# Altium project TurboToster_v.1.0.PrjPcb
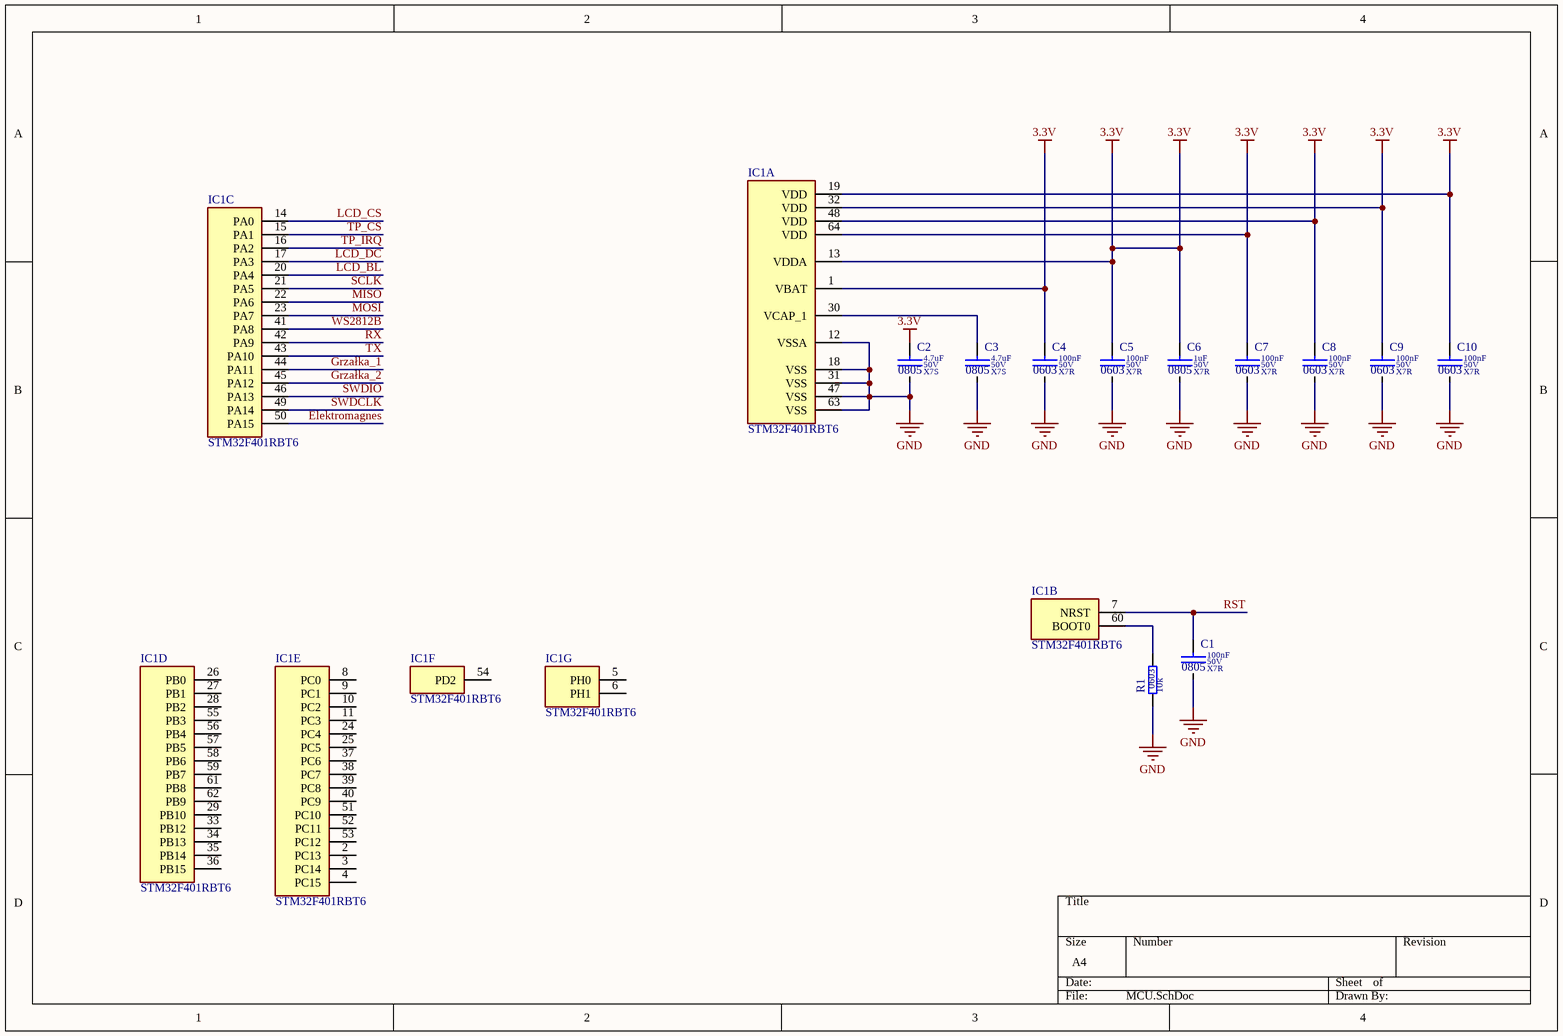
[diagram p0: MCU.SchDoc]
Numer: ---; Rev: v.1.0; Rysował: Eryk / Piotr; Tytuł: TurboToster
3 sheets, 40 parts. Net scope: global (net labels, ports and power ports of the same name join across sheets).
Board file: PCB.PcbDoc
Sheets:
  MCU.SchDoc
  Power.SchDoc
  Peripherals.SchDoc

## Sheet MCU.SchDoc
size A4; SheetNumber: 1; SheetTotal: 3

### Parts
C1  value 100nF  Dielectric: X7R  Voltage: 50V  SCH_Footprint: 0805  [C_0805_2012]  (hidden comment: Ceramic X7R)
C2  value 4.7uF  Dielectric: X7S  Voltage: 50V  SCH_Footprint: 0805  [C_0805_2012]  (hidden comment: Ceramic X7S)
C3  value 4.7uF  Dielectric: X7S  Voltage: 50V  SCH_Footprint: 0805  [C_0805_2012]  (hidden comment: Ceramic X7S)
C4  value 100nF  Dielectric: X7R  Voltage: 50V  SCH_Footprint: 0603  [C_0603_1608]  (hidden comment: Ceramic X7R)
C5  value 100nF  Dielectric: X7R  Voltage: 50V  SCH_Footprint: 0603  [C_0603_1608]  (hidden comment: Ceramic X7R)
C6  value 1uF  Dielectric: X7R  Voltage: 50V  SCH_Footprint: 0805  [C_0805_2012]  (hidden comment: Ceramic X7R)
C7  value 100nF  Dielectric: X7R  Voltage: 50V  SCH_Footprint: 0603  [C_0603_1608]  (hidden comment: Ceramic X7R)
C8  value 100nF  Dielectric: X7R  Voltage: 50V  SCH_Footprint: 0603  [C_0603_1608]  (hidden comment: Ceramic X7R)
C9  value 100nF  Dielectric: X7R  Voltage: 50V  SCH_Footprint: 0603  [C_0603_1608]  (hidden comment: Ceramic X7R)
C10  value 100nF  Dielectric: X7R  Voltage: 50V  SCH_Footprint: 0603  [C_0603_1608]  (hidden comment: Ceramic X7R)
IC1  STM32F401RBT6  [LQFP-64]  (parts A,B,C,D,E,F,G of 7)
R1  value 10k  SCH_Footprint: 0603  [R_0603_1608]  (hidden comment: Resistor)

### Nets
3.3V: C2.1 C4.1 C5.1 C6.1 C7.1 C8.1 C9.1 C10.1 IC1.1(VBAT) IC1.13(VDDA) IC1.19(VDD) IC1.32(VDD) IC1.48(VDD) IC1.64(VDD)
GND: C1.2 C2.2 C3.2 C4.2 C5.2 C6.2 C7.2 C8.2 C9.2 C10.2 IC1.12(VSSA) IC1.18(VSS) IC1.31(VSS) IC1.47(VSS) IC1.63(VSS) R1.1
Elektromagnes: IC1.50(PA15)
Grzałka_1: IC1.44(PA11)
Grzałka_2: IC1.45(PA12)
LCD_BL: IC1.20(PA4)
LCD_CS: IC1.14(PA0)
LCD_DC: IC1.17(PA3)
MISO: IC1.22(PA6)
MOSI: IC1.23(PA7)
RST: C1.1 IC1.7(NRST)
RX: IC1.42(PA9)
SCLK: IC1.21(PA5)
SWDCLK: IC1.49(PA14)
SWDIO: IC1.46(PA13)
TP_CS: IC1.15(PA1)
TP_IRQ: IC1.16(PA2)
TX: IC1.43(PA10)
WS2812B: IC1.41(PA8)
NetC3_1: C3.1 IC1.30(VCAP_1)
NetIC1_60: IC1.60(BOOT0) R1.2

Not connected (* = marked no-connect by the designer): IC1 2(PC13) 3(PC14) 4(PC15) 5(PH0) 6(PH1) 8(PC0) 9(PC1) 10(PC2) 11(PC3) 24(PC4) 25(PC5) 26(PB0) 27(PB1) 28(PB2) 29(PB10) 33(PB12) 34(PB13) 35(PB14) 36(PB15) 37(PC6) 38(PC7) 39(PC8) 40(PC9) 51(PC10) 52(PC11) 53(PC12) 54(PD2) 55(PB3) 56(PB4) 57(PB5) 58(PB6) 59(PB7) 61(PB8) 62(PB9)

### Library data of the parts
C1 = C_100nF_50V_X7R_0805_10: Capacitor; Manufacturer: AVX; Manufacturer Part Number: 08055C104K4T2A; Tolerance (%): 10; Part Number: C_100nF_50V_X7R_0805_10; HelpURL: http://www.tme.eu/pl/Document/943bdb20b23b898c4d4b2ec4eca4f2b6/cauto.pdf; Supplier 1: TME; Supplier Part Number 1: 08055C104K4T2A; Supplier 2: RS Components; Supplier 3: Farnell; Supplier 4: Mouser; Supplier 5: Digi-Key; Supplier 6: LCSC
C2 C3 = C_4.7uF_50V_X7S_0805_10: Capacitor; Manufacturer: Murata; Manufacturer Part Number: GRM21BC71H475KE11L; Tolerance (%): 10; Part Number: C_4.7uF_50V_X7S_0805_10; HelpURL: https://datasheet.octopart.com/GRM21BC71H475KE11L-Murata-datasheet-149523453.pdf; Supplier 1: TME; Supplier 2: RS Components; Supplier Part Number 2: 1726970; Supplier 3: Farnell; Supplier Part Number 3: 3582876; Supplier 4: Mouser; Supplier Part Number 4: 81-GRM21BC71H475KE1L; Supplier 5: Digi-Key; Supplier Part Number 5: 490-12757-1-ND; Supplier 6: LCSC
C4 C5 C7-C10 = C_100nF_50V_X7R_0603_5: Capacitor; Manufacturer: Samsung; Manufacturer Part Number: CL10B104JB8NNNC; Tolerance (%): 5; Part Number: C_100nF_50V_X7R_0603_5; HelpURL: http://www.tme.eu/pl/Document/4a42202b32dab16128fe107dd69598cc/samsung-chip-cap.pdf; Supplier 1: TME; Supplier Part Number 1: CL10B104JB8NNNC; Supplier 2: RS Components; Supplier Part Number 2: 7665455; Supplier 3: Farnell; Supplier 4: Mouser; Supplier 5: Digi-Key; Supplier Part Number 5: 1276-1033-1-ND; Supplier 6: LCSC; Supplier Part Number 6: C24452
C6 = C_1uF_50V_X7R_0805_10: Capacitor; Manufacturer: AVX; Manufacturer Part Number: 08055C105KAT2A; Tolerance (%): 10; Part Number: C_1uF_50V_X7R_0805_10; HelpURL: https://sigma.octopart.com/147443767/technical_drawing/AVX-08055C105KAT2A.pdf; Supplier 1: TME; Supplier Part Number 1: 08055C105KAT2A; Supplier 2: RS Components; Supplier Part Number 2: 1441427; Supplier 3: Farnell; Supplier Part Number 3: 2094043; Supplier 4: Mouser; Supplier Part Number 4: 581-08055C105KAT2A; Supplier 5: Digi-Key; Supplier Part Number 5: 478-7956-1-ND; Supplier 6: LCSC
IC1 = STM32F401RBT6: ARM Microcontroller
R1 = R_10k_0603_1: Manufacturer: Vishay; Manufacturer Part Number: CRCW060310K0FKTABC; Voltage: 75V; Power: 100mW; Tolerance: 1%; Part Number: R_10k_0603_1; HelpURL: http://www.tme.eu/pl/Document/622e28308c06d160637f2b14751ba16b/Data%20Sheet%20CRCW_BCe3.pdf; Supplier 1: TME; Supplier Part Number 1: CRCW060310K0FKTABC; Supplier 2: RS Components; Supplier 3: Farnell; Supplier 4: Mouser; Supplier Part Number 4: 667-ERJ-3EKF1002V; Supplier 5: Digi-Key; Supplier Part Number 5: P10KGCT-ND; Supplier 6: LCSC

## Sheet Power.SchDoc
size A4; SheetNumber: 2; SheetTotal: 3
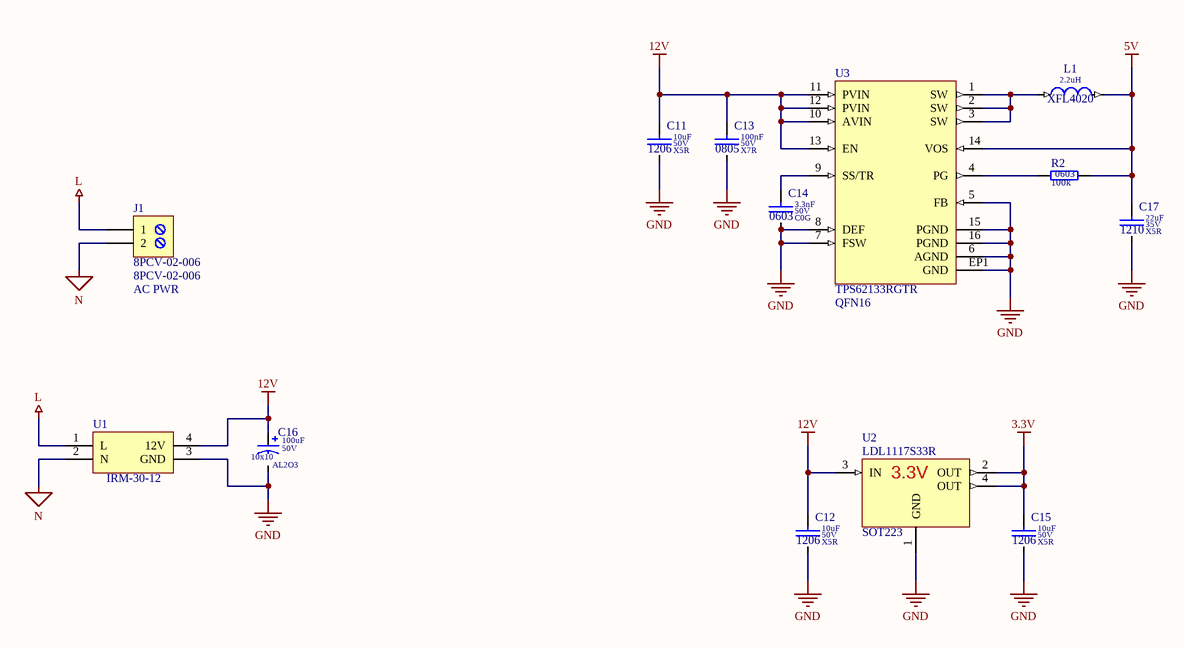
[diagram p1: Power.SchDoc]

### Parts
C11  value 10uF  Dielectric: X5R  Voltage: 50V  SCH_Footprint: 1206  [C_1206_3216]  (hidden comment: Ceramic X5R)
C12  value 10uF  Dielectric: X5R  Voltage: 50V  SCH_Footprint: 1206  [C_1206_3216]  (hidden comment: Ceramic X5R)
C13  value 100nF  Dielectric: X7R  Voltage: 50V  SCH_Footprint: 0805  [C_0805_2012]  (hidden comment: Ceramic X7R)
C14  value 3.3nF  Dielectric: C0G  Voltage: 50V  SCH_Footprint: 0603  [C_0603_1608]  (hidden comment: Ceramic C0G)
C15  value 10uF  Dielectric: X5R  Voltage: 50V  SCH_Footprint: 1206  [C_1206_3216]  (hidden comment: Ceramic X5R)
C16  value 100uF  Dielectric: AL2O3  SCH_Footprint: 10x10  Voltage: 50V  [CE_D_10x10_SMD]  (hidden comment: Electrolytic Capacitor)
C17  value 22uF  Dielectric: X5R  Voltage: 35V  SCH_Footprint: 1210  [C_1210_3225]  (hidden comment: Ceramic X5R)
J1  value 8PCV-02-006  [J_8PCV-02-006]  (hidden comment: 600V 30A connector)
L1  value 2.2uH  [XFL4020]  (hidden comment: Inductor)
R2  value 100k  SCH_Footprint: 0603  [R_0603_1608]  (hidden comment: Resistor)
U1  IRM-30-12  [IRM-30-12]
U2  SCH_Footprint: SOT223  [SOT223_SC73]  (hidden comment: LDL1117S33R)
U3  SCH_Footprint: QFN16  [QFN16_3x3]  (hidden comment: TPS62133RGTR)

### Nets
3.3V: C15.1 U2.2(OUT) U2.4(OUT)
5V: C17.1 L1.2 R2.2 U3.14(VOS)
12V: C11.1 C12.1 C13.1 C16.1 U1.4(12V) U2.3(IN) U3.10(AVIN) U3.11(PVIN) U3.12(PVIN) U3.13(EN)
GND: C11.2 C12.2 C13.2 C14.2 C15.2 C16.2 C17.2 U1.3(GND) U2.1(GND) U3.5(FB) U3.6(AGND) U3.7(FSW) U3.8(DEF) U3.15(PGND) U3.16(PGND) U3.EP1(GND)
L: J1.1 U1.1(L)
N: J1.2 U1.2(N)
NetC14_1: C14.1 U3.9(SS/TR)
NetL1_1: L1.1 U3.1(SW) U3.2(SW) U3.3(SW)
NetR2_1: R2.1 U3.4(PG)

### Notes on the sheet
- (near J1) AC PWR

### Library data of the parts
C11 C12 C15 = C_10uF_50V_X5R_1206_10: Capacitor; Manufacturer: Murata; Manufacturer Part Number: GRM31CR61H106KA12L; Tolerance (%): 10; Part Number: C_10uF_50V_X5R_1206_10; HelpURL: https://datasheet.octopart.com/GRM31CR61H106KA12L-Murata-datasheet-138746367.pdf; Supplier 1: TME; Supplier Part Number 1: GRM31CR61H106KA12L; Supplier 2: RS Components; Supplier 3: Farnell; Supplier Part Number 3: 1845762; Supplier 4: Mouser; Supplier 5: Digi-Key; Supplier 6: LCSC
C13 = C_100nF_50V_X7R_0805_10: as C1 on sheet MCU; Part Number: C_100nF_50V_X7R_0805_10; HelpURL: http://www.tme.eu/pl/Document/943bdb20b23b898c4d4b2ec4eca4f2b6/cauto.pdf; Supplier 1: TME; Supplier Part Number 1: 08055C104K4T2A; Supplier 2: RS Components; Supplier 3: Farnell; Supplier 4: Mouser; Supplier 5: Digi-Key; Supplier 6: LCSC
C14 = C_3.3nF_50V_C0G_0603_5: Capacitor; Manufacturer: Murata; Manufacturer Part Number: GRM1885C1H332JA01D; Tolerance (%): 5; Part Number: C_3.3nF_50V_C0G_0603_5; HelpURL: https://www.murata.com/~/media/webrenewal/support/library/catalog/products/capacitor/mlcc/c02e.ashx; Supplier 1: TME; Supplier Part Number 1: GRM1885C1H332JA01D; Supplier 2: RS Components; Supplier Part Number 2: 7235900; Supplier 3: Farnell; Supplier Part Number 3: 2470483; Supplier 4: Mouser; Supplier Part Number 4: 81-GRM1885C1H332JA1D; Supplier 5: Digi-Key; Supplier Part Number 5: 490-6385-1-ND; Supplier 6: LCSC
C16 = CE_100uF_50V_AL2O3_10x10_20: Polarized Capacitor; Manufacturer: Nichicon; Manufacturer Part Number: UUX1H101MNL1GS; Tolerance (%): 20; Part Number: CE_100uF_50V_AL2O3_10x10_20; HelpURL: https://datasheet.octopart.com/UUX1H101MNL1GS-Nichicon-datasheet-62047998.pdf; Supplier 1: TME; Supplier Part Number 1: UUX1H101MNL1GS; Supplier 2: RS Components; Supplier Part Number 2: 7393107; Supplier 3: Farnell; Supplier Part Number 3: 2841943; Supplier 4: Mouser; Supplier Part Number 4: 647-UUX1H101MNL1GS; Supplier 5: Digi-Key; Supplier Part Number 5: 493-6269-1-ND; Supplier 6: LCSC
C17 = C_22uF_35V_X5R_1210_20: Capacitor; Manufacturer: Taiyo Yuden; Manufacturer Part Number: GMK325BJ226MM-P; Tolerance (%): 20; Part Number: C_22uF_35V_X5R_1210_20; HelpURL: https://datasheet.octopart.com/GMK325BJ226MM-P-Taiyo-Yuden-datasheet-138516745.pdf; Supplier 1: TME; Supplier 2: RS Components; Supplier Part Number 2: 103-4209; Supplier 3: Farnell; Supplier 4: Mouser; Supplier Part Number 4: 963-GMK325BJ226MM-P; Supplier 5: Digi-Key; Supplier Part Number 5: 587-5853-6-ND; Supplier 6: LCSC
J1 = J_8PCV-02-006: ARK Screw terminal, 2-Pin; Manufacturer: TE Connectivity; SCH_Footprint: 8PCV-02-006; Part Number: J_8PCV-02-006; HelpURL: http://www.mouser.com/ds/2/418/NG_CD_6-1437657-3_K4-669783.pdf; Manufacturer Part Number: 8PCV-02-006; Supplier 1: TME; Supplier 2: RS Components; Supplier Part Number 2: 7176637; Supplier 3: Farnell; Supplier 4: Mouser; Supplier Part Number 4: 571-514376577; Supplier 5: Digi-Key; Supplier Part Number 5: A98460-ND; Supplier 6: LCSC
L1 = L_2.2uH_8A_XFL4020: Induction; Manufacturer: Coilcraft; Manufacturer Part Number: XFL4020-222MEC; Current: 8A; Resistance: 23.5mR; SCH_Footprint: XFL4020; Part Number: L_2.2uH_8A_XFL4020; HelpURL: https://pl.mouser.com/datasheet/2/597/xfl4020-270756.pdf; Supplier 1: TME; Supplier 2: RS Components; Supplier 3: Farnell; Supplier Part Number 3: 2289216; Supplier 4: Mouser; Supplier Part Number 4: 994-XFL4020-222MEC; Supplier 5: Digi-Key; Supplier 6: LCSC; Supplier 7: Coilcraft; Supplier Part Number 7: XFL4020-222MEC
R2 = R_100k_0603_1: Manufacturer: Royalohm; Manufacturer Part Number: 0603SAF1003T5E; Voltage: 50V; Power: 100mW; Tolerance: 1%; Part Number: R_100k_0603_1; HelpURL: http://www.tme.eu/pl/Document/b315665a56acbc42df513c99b390ad98/ROYALOHM-THICKFILM.pdf; Supplier 1: TME; Supplier Part Number 1: SMD0603-100K-1%; Supplier 2: RS Components; Supplier 3: Farnell; Supplier 4: Mouser; Supplier Part Number 4: 667-ERJ-3EKF1003V; Supplier 5: Digi-Key; Supplier Part Number 5: P100KHCT-ND; Supplier 6: LCSC
U1 = IRM-30-12: IRM-30-12 Mean Well
U2 = VL_LDL1117S33R: typical configuration; Manufacturer: STMicroelectronics; Voltage: 3.3V; Current: 1.2A; Value: LDL1117S33R; Part Number: VL_LDL1117S33R; HelpURL: https://www.st.com/resource/en/datasheet/ldl1117.pdf; Manufacturer Part Number: LDL1117S33R; Supplier 1: TME; Supplier Part Number 1: LDL1117S33R; Supplier 2: RS Components; Supplier 3: Farnell; Supplier Part Number 3: 2729708; Supplier 4: Mouser; Supplier Part Number 4: 511-LDL1117S33R; Supplier 5: Digi-Key; Supplier Part Number 5: 497-17239-1-ND; Supplier 6: LCSC
U3 = VS_TPS62133RGTR: 3-17V 3A Step-Down Converter with DCS-Control in 3x3 QFN; Manufacturer: Texas Instruments; Frequency (kHz): 2500; Topology: Buck; Vin min (V): 3; Vin max (V): 17; Vout min (V): 5; Iswitch (A): 0; Value: TPS62133RGTR; Part Number: VS_TPS62133RGTR; Vout max (V): 5; Imax (A): 3; HelpURL: https://www.ti.com/lit/ds/symlink/tps62133.pdf?ts=1622201106793&ref_url=https%253A%252F%252Fwww.ti.com%252Fproduct%252FTPS62133%253FHQS%253DTI-null-null-octopart-df-pf-null-wwe; Manufacturer Part Number: TPS62133RGTR; Supplier 1: TME; Supplier 2: RS Components; Supplier 3: Farnell; Supplier Part Number 3: 3122975; Supplier 4: Mouser; Supplier Part Number 4: 595-TPS62133RGTR; Supplier 5: Digi-Key; Supplier Part Number 5: 296-29937-1-ND; Supplier 6: LCSC; Supplier Part Number 6: C73973

## Sheet Peripherals.SchDoc
size A4; SheetNumber: 3; SheetTotal: 3
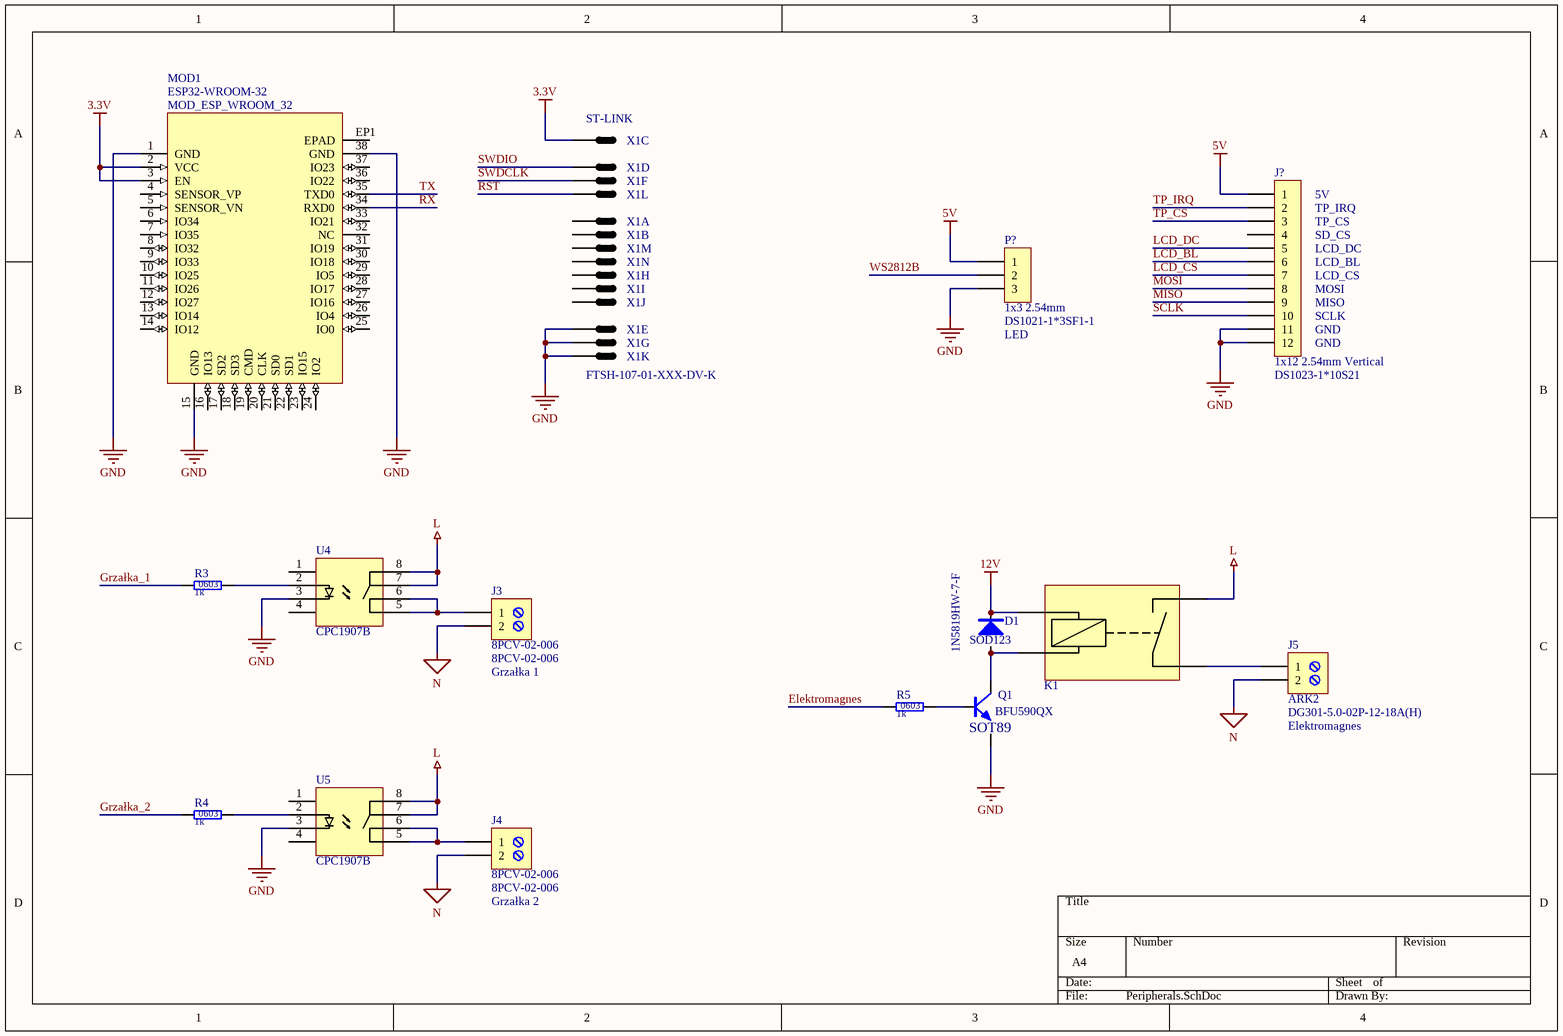
[diagram p2: Peripherals.SchDoc]

### Parts
D1  value 1N5819HW-7-F  [SOD123]  (hidden comment: 1N5819HW)
J3  value 8PCV-02-006  [J_8PCV-02-006]  (hidden comment: 600V 30A connector)
J4  value 8PCV-02-006  [J_8PCV-02-006]  (hidden comment: 600V 30A connector)
J5  value DG301-5.0-02P-12-18A(H)  [J_ARK2]  (hidden comment: ARK2)
J?  value DS1023-1*10S21  SCH_Footprint: 1x12 2.54mm Vertical  [J_HEADER_1x12_2.54_VERTICAL]  (hidden comment: Goldpin female straight)
K1  FTR-F3AA012E  [FTR-F3AA012E]  (value not drawn)
MOD1  value ESP32-WROOM-32  [MOD_ESP_WROOM_32]  (hidden comment: 2.4 GHz Wi-Fi-and-Bluetooth combo chip)
P?  value DS1021-1*3SF1-1  SCH_Footprint: 1x3 2.54mm  [P_HEADER_1x3_2.54]  (hidden comment: Goldpin)
Q1  SCH_Footprint: SOT89  [SOT89_TO-243AA_N]  (hidden comment: BFU590QX)
R3  value 1k  SCH_Footprint: 0603  [R_0603_1608]  (hidden comment: Resistor)
R4  value 1k  SCH_Footprint: 0603  [R_0603_1608]  (hidden comment: Resistor)
R5  value 1k  SCH_Footprint: 0603  [R_0603_1608]  (hidden comment: Resistor)
U4  CPC1907B  [CPC1907B]
U5  CPC1907B  [CPC1907B]
X1  FTSH-107-01-XXX-DV-K  [FTSH-107-01-XXX-DV-K]  (value not drawn)  (parts A,B,C,D,E,F,G,H,I,J,K,L,M,N of 14)

### Nets
3.3V: MOD1.2(VCC) MOD1.3(EN) X1.3
5V: J?.1 P?.1
12V: D1.1 K1.1
GND: J?.11 J?.12 MOD1.1(GND) MOD1.15(GND) MOD1.38(GND) P?.3 Q1.1(E) U4.3 U5.3 X1.5 X1.7 X1.11
L: K1.3 U4.7 U4.8 U5.7 U5.8
N: J3.2 J4.2 J5.2
Elektromagnes: R5.1
Grzałka_1: R3.1
Grzałka_2: R4.1
LCD_BL: J?.6
LCD_CS: J?.7
LCD_DC: J?.5
MISO: J?.9
MOSI: J?.8
RST: X1.12
RX: MOD1.34(RXD0)
SCLK: J?.10
SWDCLK: X1.6
SWDIO: X1.4
TP_CS: J?.3
TP_IRQ: J?.2
TX: MOD1.35(TXD0)
WS2812B: P?.2
NetD1_2: D1.2 K1.2 Q1.2(C)
NetJ3_1: J3.1 U4.5 U4.6
NetJ4_1: J4.1 U5.5 U5.6
NetJ5_1: J5.1 K1.4
NetQ1_3: Q1.3(B) R5.2
NetR3_2: R3.2 U4.2
NetR4_2: R4.2 U5.2

Not connected (* = marked no-connect by the designer): J? 4; MOD1 4(SENSOR_VP) 5(SENSOR_VN) 6(IO34) 7(IO35) 8(IO32) 9(IO33) 10(IO25) 11(IO26) 12(IO27) 13(IO14) 14(IO12) 16(IO13) 17(SD2) 18(SD3) 19(CMD) 20(CLK) 21(SD0) 22(SD1) 23(IO15) 24(IO2) 25(IO0) 26(IO4) 27(IO16) 28(IO17) 29(IO5) 30(IO18) 31(IO19) 32(NC) 33(IO21) 36(IO22) 37(IO23) EP1(EPAD); U4 1 4; U5 1 4; X1 1 2 8 9 10 13 14

### Notes on the sheet
- (near X1) ST-LINK
- (near J?) 5V
- (near J?) TP_IRQ
- (near J?) TP_CS
- (near J?) SD_CS
- (near J?) LCD_DC
- (near J?) LCD_BL
- (near J?) LCD_CS
- (near J?) MOSI
- (near J?) MISO
- (near J?) SCLK
- (near P?) LED
- (near J?) GND
- (near J3) Grzałka 1
- (near J5) Elektromagnes
- (near J4) Grzałka 2

### Library data of the parts
D1 = D_1N5819HW_1A_40V_SOD123: Manufacturer: Diodes Inc; Voltage: 40V; Current: 1A; SCH_Footprint: SOD123; Part Number: D_1N5819HW_1A_40V_SOD123; HelpURL: https://datasheet.octopart.com/1N5819HW-7-F-Diodes-Inc.-datasheet-8332965.pdf; Manufacturer Part Number: 1N5819HW-7-F; Supplier 1: TME; Supplier Part Number 1: 1N5819HW-7-F; Supplier 2: RS Components; Supplier Part Number 2: 7082197; Supplier 3: Farnell; Supplier Part Number 3: 1773475; Supplier 4: Mouser; Supplier Part Number 4: 621-1N5819HW-F; Supplier 5: Digi-Key; Supplier Part Number 5: 1N5819HW-FDICT-ND; Supplier 6: LCSC
J3 J4 = J_8PCV-02-006: as J1 on sheet Power; SCH_Footprint: 8PCV-02-006; Part Number: J_8PCV-02-006; HelpURL: http://www.mouser.com/ds/2/418/NG_CD_6-1437657-3_K4-669783.pdf; Manufacturer Part Number: 8PCV-02-006; Supplier 1: TME; Supplier 2: RS Components; Supplier Part Number 2: 7176637; Supplier 3: Farnell; Supplier 4: Mouser; Supplier Part Number 4: 571-514376577; Supplier 5: Digi-Key; Supplier Part Number 5: A98460-ND; Supplier 6: LCSC
J5 = J_TB-5.0-P-2P: ARK Screw terminal, 2-Pin; Manufacturer: DEGSON ELECTRONICS; SCH_Footprint: ARK2; Part Number: J_TB-5.0-P-2P; HelpURL: https://datasheet.octopart.com/DG301-5.0-03P-12-18A%28H%29-Degson-datasheet-17801202.pdf; Manufacturer Part Number: DG301-5.0-02P-12-18A(H); Supplier 1: TME; Supplier Part Number 1: DG301-5.0-2/6B; Supplier 2: RS Components; Supplier 3: Farnell; Supplier 4: Mouser; Supplier 5: Digi-Key; Supplier 6: LCSC
J? = J_HEADER_1x12_2.54_VERTICAL: Pin Header; Manufacturer: Connfly; Part Number: J_HEADER_1x12_2.54_VERTICAL; HelpURL: https://www.tme.eu/Document/efd0203e2d3a140765df98191085ea88/DS1023.pdf; Manufacturer Part Number: DS1023-1*10S21; Supplier 1: TME; Supplier Part Number 1: ZL262-10SG; Supplier 2: RS Components; Supplier 3: Farnell; Supplier 4: Mouser; Supplier 5: Digi-Key; Supplier 6: LCSC
MOD1 = MOD_ESP32-WROOM-32: Manufacturer: ESPRESSIF; SCH_Footprint: MOD_ESP_WROOM_32; Part Number: MOD_ESP32-WROOM-32; HelpURL: https://www.espressif.com/sites/default/files/documentation/esp32-wroom-32d_esp32-wroom-32u_datasheet_en.pdf; Manufacturer Part Number: ESP32-WROOM-32; Supplier 1: TME; Supplier Part Number 1: ESP32-WROOM-32; Supplier 2: RS Components; Supplier Part Number 2: 169-7594; Supplier 3: Farnell; Supplier 4: Mouser; Supplier Part Number 4: 356-ESP-WROOM-32; Supplier 5: Digi-Key; Supplier Part Number 5: 1904-1010-1-ND; Supplier 6: LCSC
P? = P_HEADER_1x3_2.54: Pin Header; Manufacturer: Connfly; Part Number: P_HEADER_1x3_2.54; HelpURL: http://www.tme.eu/en/Document/cc301e58a5da78cb543a94b5a5b7f06a/DS1021.pdf; Manufacturer Part Number: DS1021-1*3SF1-1; Supplier 1: TME; Supplier Part Number 1: ZL201-03G; Supplier 2: RS Components; Supplier 3: Farnell; Supplier 4: Mouser; Supplier 5: Digi-Key; Supplier 6: LCSC
Q1 = QNP_BFU590QX: Manufacturer: NXP; Type: NPN; Voltage: 12V; Current: 200mA; Part Number: QNP_BFU590QX; Value: BFU590QX; HelpURL: https://www.nxp.com/docs/en/data-sheet/BFU590Q.pdf; Manufacturer Part Number: BFU590QX; Supplier 1: TME; Supplier 2: RS Components; Supplier 3: Farnell; Supplier Part Number 3: 2776273; Supplier 4: Mouser; Supplier Part Number 4: 771-BFU590QX; Supplier 5: Digi-Key; Supplier Part Number 5: 568-11522-1-ND; Supplier 6: LCSC
R3-R5 = R_1k_0603_1: Manufacturer: Vishay; Manufacturer Part Number: CRCW06031K00FKEA; Voltage: 75V; Power: 100mW; Tolerance: 1%; Part Number: R_1k_0603_1; HelpURL: http://www.farnell.com/datasheets/2310790.pdf?_ga=2.256888843.1690599162.1548417389-1379097396.1542296996&_gac=1.262631934.1547230258.Cj0KCQiAmuHhBRD0ARIsAFWyPwhX8HcvXnM3tA0ZBodZLzDIjH2ZxLpjT5LWo9bad_HPRbU8LfPq44UaAhEwEALw_wcB; Supplier 1: TME; Supplier 2: RS Components; Supplier Part Number 2: 678-9875P; Supplier 3: Farnell; Supplier Part Number 3: 1469740; Supplier 4: Mouser; Supplier Part Number 4: 71-CRCW0603-1.0K-E3; Supplier 5: Digi-Key; Supplier Part Number 5: 541-1.00KHCT-ND; Supplier 6: LCSC
X1 = FTSH-107-01-XXX-DV-K: IDC 14pin male connector

## Nets that join several sheets
3.3V: MCU (14 pins), Power (C15.1 U2.2 U2.4), Peripherals (MOD1.2 MOD1.3 X1.3)
5V: Power (C17.1 L1.2 R2.2 U3.14), Peripherals (J?.1 P?.1)
12V: Power (10 pins), Peripherals (D1.1 K1.1)
GND: MCU (16 pins), Power (16 pins), Peripherals (12 pins)
L: Power (J1.1 U1.1), Peripherals (5 pins)
N: Power (J1.2 U1.2), Peripherals (J3.2 J4.2 J5.2)
Elektromagnes: MCU (IC1.50), Peripherals (R5.1)
Grzałka_1: MCU (IC1.44), Peripherals (R3.1)
Grzałka_2: MCU (IC1.45), Peripherals (R4.1)
LCD_BL: MCU (IC1.20), Peripherals (J?.6)
LCD_CS: MCU (IC1.14), Peripherals (J?.7)
LCD_DC: MCU (IC1.17), Peripherals (J?.5)
MISO: MCU (IC1.22), Peripherals (J?.9)
MOSI: MCU (IC1.23), Peripherals (J?.8)
RST: MCU (C1.1 IC1.7), Peripherals (X1.12)
RX: MCU (IC1.42), Peripherals (MOD1.34)
SCLK: MCU (IC1.21), Peripherals (J?.10)
SWDCLK: MCU (IC1.49), Peripherals (X1.6)
SWDIO: MCU (IC1.46), Peripherals (X1.4)
TP_CS: MCU (IC1.15), Peripherals (J?.3)
TP_IRQ: MCU (IC1.16), Peripherals (J?.2)
TX: MCU (IC1.43), Peripherals (MOD1.35)
WS2812B: MCU (IC1.41), Peripherals (P?.2)